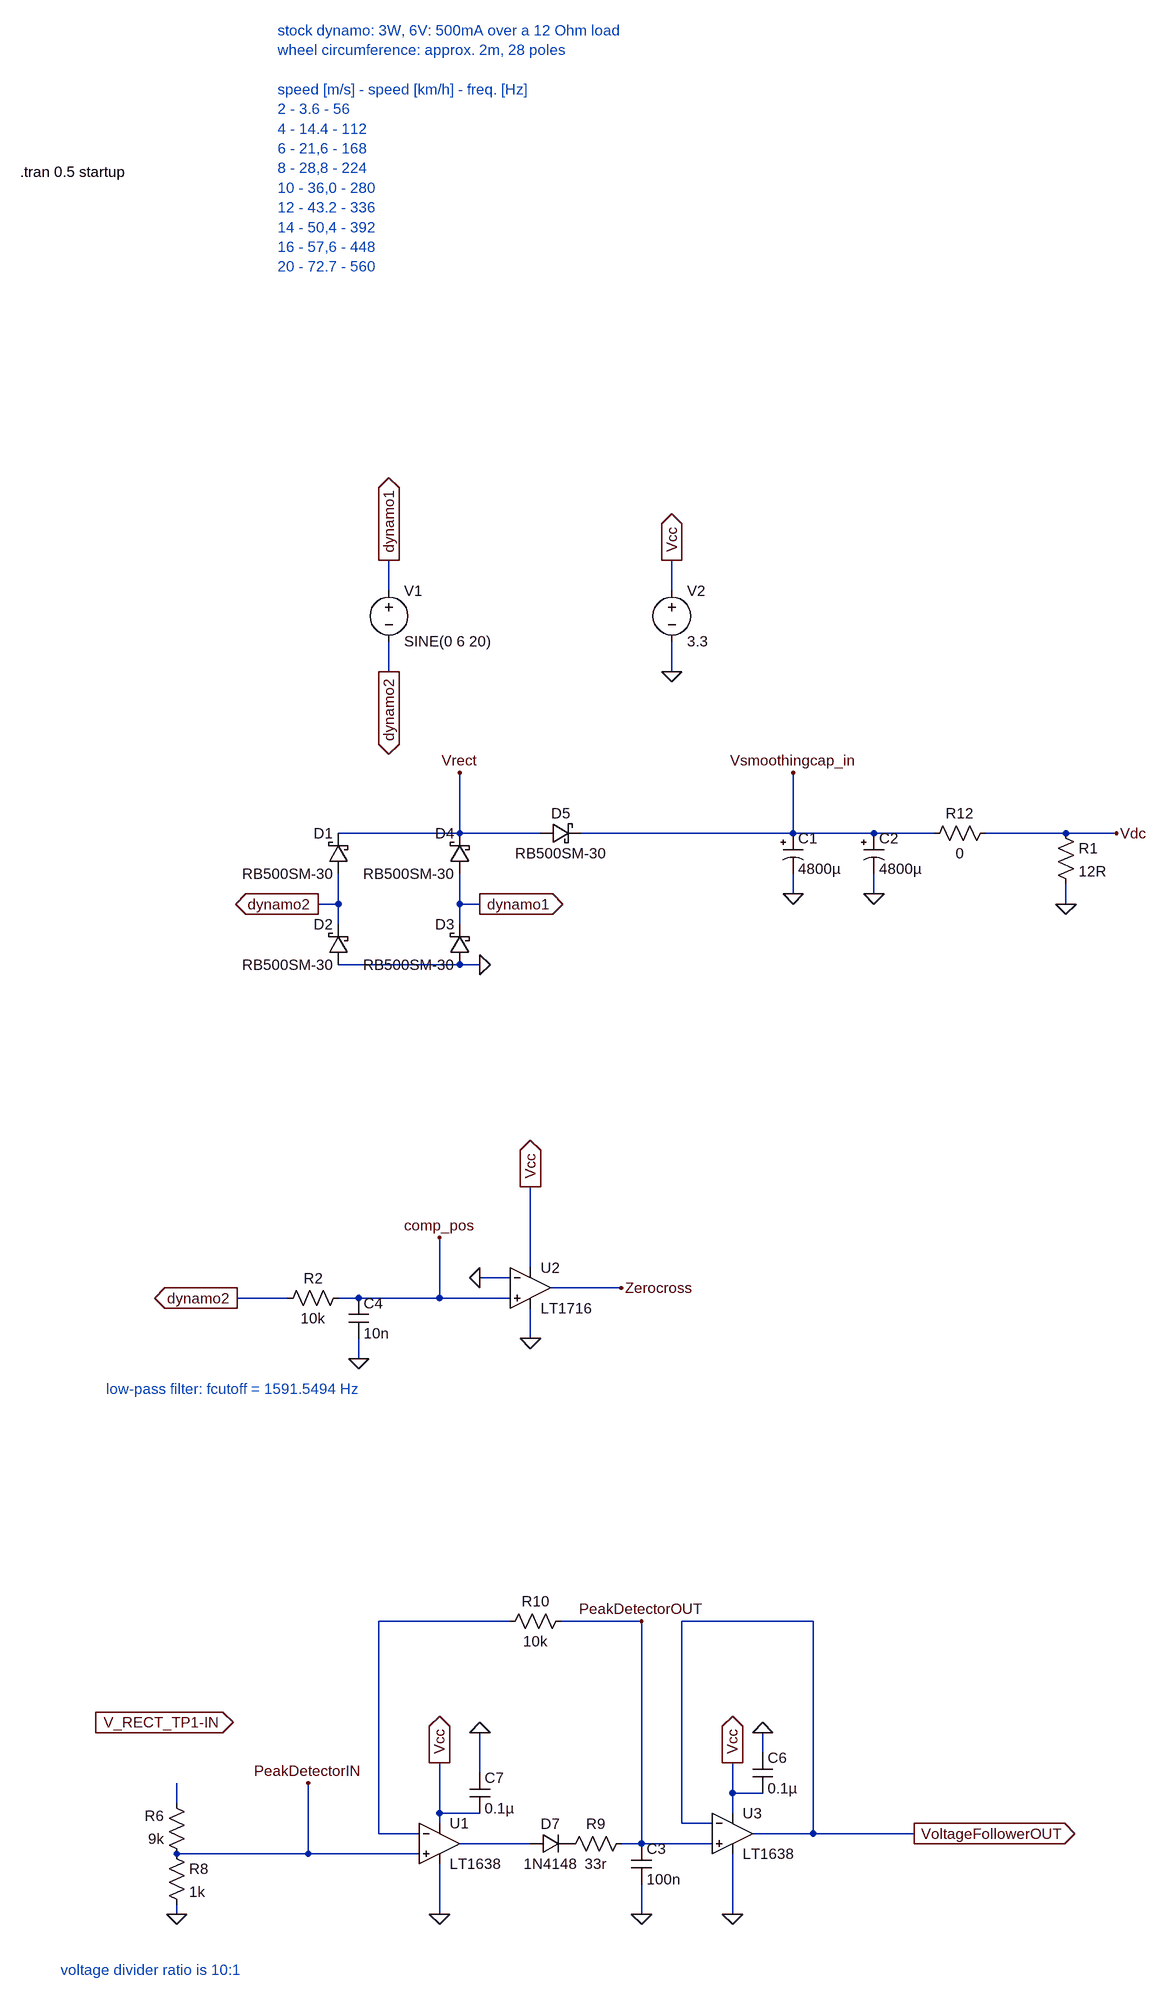
[diagram p0: schematic graetz and zero cross.asc]
graetz and zero cross.asc, the LTspice schematic file:
Version 4.1
SHEET 1 4188 3140
WIRE -992 32 -992 -16
WIRE -544 32 -544 -16
WIRE -992 160 -992 112
WIRE -544 160 -544 112
WIRE -880 416 -880 320
WIRE -880 416 -1072 416
WIRE -752 416 -880 416
WIRE -352 416 -352 320
WIRE -352 416 -688 416
WIRE -224 416 -352 416
WIRE -128 416 -224 416
WIRE 80 416 -48 416
WIRE 160 416 80 416
WIRE -352 512 -352 480
WIRE -224 512 -224 480
WIRE -1072 528 -1072 480
WIRE -1072 528 -1104 528
WIRE -880 528 -880 480
WIRE -848 528 -880 528
WIRE 80 528 80 496
WIRE -1072 560 -1072 528
WIRE -880 560 -880 528
WIRE -880 624 -1072 624
WIRE -848 624 -880 624
WIRE -768 1104 -768 976
WIRE -800 1120 -848 1120
WIRE -624 1136 -736 1136
WIRE -1152 1152 -1232 1152
WIRE -1040 1152 -1072 1152
WIRE -912 1152 -912 1056
WIRE -912 1152 -1040 1152
WIRE -800 1152 -912 1152
WIRE -768 1216 -768 1168
WIRE -1040 1248 -1040 1216
WIRE -800 1664 -1008 1664
WIRE -592 1664 -720 1664
WIRE -320 1664 -528 1664
WIRE -400 1872 -400 1840
WIRE -848 1904 -848 1840
WIRE -448 1936 -448 1888
WIRE -400 1936 -448 1936
WIRE -1328 1952 -1328 1920
WIRE -912 1968 -912 1888
WIRE -848 1968 -912 1968
WIRE -448 1968 -448 1936
WIRE -912 1984 -912 1968
WIRE -528 1984 -528 1664
WIRE -480 1984 -528 1984
WIRE -1008 2000 -1008 1664
WIRE -944 2000 -1008 2000
WIRE -320 2000 -320 1664
WIRE -320 2000 -416 2000
WIRE -160 2000 -320 2000
WIRE -768 2016 -880 2016
WIRE -592 2016 -592 1664
WIRE -592 2016 -624 2016
WIRE -480 2016 -592 2016
WIRE -1120 2032 -1120 1920
WIRE -1120 2032 -1328 2032
WIRE -944 2032 -1120 2032
WIRE -1328 2128 -1328 2112
WIRE -912 2128 -912 2048
WIRE -592 2128 -592 2080
WIRE -448 2128 -448 2032
FLAG -992 -16 dynamo1
IOPIN -992 -16 Out
FLAG -992 160 dynamo2
IOPIN -992 160 Out
FLAG -848 624 0
FLAG 80 528 0
FLAG -848 528 dynamo1
IOPIN -848 528 Out
FLAG -1104 528 dynamo2
IOPIN -1104 528 Out
FLAG -352 512 0
FLAG -224 512 0
FLAG -544 160 0
FLAG -544 -16 Vcc
IOPIN -544 -16 Out
FLAG -768 1216 0
FLAG -1232 1152 dynamo2
IOPIN -1232 1152 Out
FLAG -592 2128 0
FLAG -912 2128 0
FLAG -1328 2128 0
FLAG -1456 1824 V_RECT_TP1-IN
IOPIN -1456 1824 Out
FLAG -448 2128 0
FLAG -160 2000 VoltageFollowerOUT
IOPIN -160 2000 Out
FLAG -1120 1920 PeakDetectorIN
FLAG -592 1664 PeakDetectorOUT
FLAG -400 1840 0
FLAG -848 1840 0
FLAG -1040 1248 0
FLAG -912 1056 comp_pos
FLAG -448 1888 Vcc
IOPIN -448 1888 Out
FLAG -912 1888 Vcc
IOPIN -912 1888 Out
FLAG -848 1120 0
FLAG -768 976 Vcc
IOPIN -768 976 Out
FLAG -880 320 Vrect
FLAG -352 320 Vsmoothingcap_in
FLAG 160 416 Vdc
FLAG -624 1136 Zerocross
SYMBOL voltage -992 16 R0
WINDOW 123 24 124 Left 2
WINDOW 39 0 0 Left 0
SYMATTR InstName V1
SYMATTR Value SINE(0 6 20)
SYMBOL res 64 400 R0
SYMATTR InstName R1
SYMATTR Value 12R
SYMBOL schottky -1056 480 R180
WINDOW 0 24 64 Left 2
WINDOW 3 24 0 Left 2
SYMATTR InstName D1
SYMATTR Value RB500SM-30
SYMATTR Description Diode
SYMATTR Type diode
SYMBOL schottky -1056 624 R180
WINDOW 0 24 64 Left 2
WINDOW 3 24 0 Left 2
SYMATTR InstName D2
SYMATTR Value RB500SM-30
SYMATTR Description Diode
SYMATTR Type diode
SYMBOL schottky -864 624 R180
WINDOW 0 24 64 Left 2
WINDOW 3 24 0 Left 2
SYMATTR InstName D3
SYMATTR Value RB500SM-30
SYMATTR Description Diode
SYMATTR Type diode
SYMBOL schottky -864 480 R180
WINDOW 0 24 64 Left 2
WINDOW 3 24 0 Left 2
SYMATTR InstName D4
SYMATTR Value RB500SM-30
SYMATTR Description Diode
SYMATTR Type diode
SYMBOL polcap -368 416 R0
SYMATTR InstName C1
SYMATTR Value 4800µ
SYMBOL schottky -752 432 R270
WINDOW 0 32 32 VTop 2
WINDOW 3 0 32 VBottom 2
SYMATTR InstName D5
SYMATTR Value RB500SM-30
SYMATTR Description Diode
SYMATTR Type diode
SYMBOL voltage -544 16 R0
WINDOW 123 0 0 Left 0
WINDOW 39 0 0 Left 0
SYMATTR InstName V2
SYMATTR Value 3.3
SYMBOL polcap -240 416 R0
SYMATTR InstName C2
SYMATTR Value 4800µ
SYMBOL Opamps\\LT1638 -912 1952 R0
SYMATTR InstName U1
SYMBOL diode -768 2032 R270
WINDOW 0 32 32 VTop 2
WINDOW 3 0 32 VBottom 2
SYMATTR InstName D7
SYMATTR Value 1N4148
SYMBOL cap -608 2016 R0
SYMATTR InstName C3
SYMATTR Value 100n
SYMBOL res -1312 2048 R180
WINDOW 0 36 76 Left 2
WINDOW 3 36 40 Left 2
SYMATTR InstName R6
SYMATTR Value 9k
SYMBOL res -1344 2016 R0
SYMATTR InstName R8
SYMATTR Value 1k
SYMBOL Opamps\\LT1638 -448 1936 R0
SYMATTR InstName U3
SYMBOL res -608 2000 R90
WINDOW 0 0 56 VBottom 2
WINDOW 3 32 56 VTop 2
SYMATTR InstName R9
SYMATTR Value 33r
SYMBOL res -704 1648 R90
WINDOW 0 0 56 VBottom 2
WINDOW 3 32 56 VTop 2
SYMATTR InstName R10
SYMATTR Value 10k
SYMBOL cap -416 1872 R0
SYMATTR InstName C6
SYMATTR Value 0.1µ
SYMBOL cap -864 1904 R0
SYMATTR InstName C7
SYMATTR Value 0.1µ
SYMBOL cap -1056 1152 R0
SYMATTR InstName C4
SYMATTR Value 10n
SYMBOL res -1056 1136 R90
WINDOW 0 0 56 VBottom 2
WINDOW 3 32 56 VTop 2
SYMATTR InstName R2
SYMATTR Value 10k
SYMBOL Comparators\\LT1716 -768 1136 R0
SYMATTR InstName U2
SYMBOL res -32 400 R90
WINDOW 0 0 56 VBottom 2
WINDOW 3 32 56 VTop 2
SYMATTR InstName R12
SYMATTR Value 0
TEXT -1168 -856 Left 2 ;stock dynamo: 3W, 6V: 500mA over a 12 Ohm load\nwheel circumference: approx. 2m, 28 poles\n \nspeed [m/s] - speed [km/h] - freq. [Hz]\n2 - 3.6 - 56\n4 - 14.4 - 112\n6 - 21,6 - 168\n8 - 28,8 - 224\n10 - 36,0 - 280\n12 - 43.2 - 336\n14 - 50,4 - 392\n16 - 57,6 - 448\n20 - 72.7 - 560
TEXT -1440 1296 Left 2 ;low-pass filter: fcutoff = 1591.5494 Hz
TEXT -1576 -632 Left 2 !.tran 0.5 startup
TEXT -1512 2216 Left 2 ;voltage divider ratio is 10:1

The netlist it stands for:
* graetz and zero cross.asc
V1 dynamo1 dynamo2 SINE(0 6 20)
R1 Vdc 0 12R
D1 dynamo2 Vrect RB500SM-30
D2 0 dynamo2 RB500SM-30
D3 0 dynamo1 RB500SM-30
D4 dynamo1 Vrect RB500SM-30
C1 Vsmoothingcap_in 0 4800µ
D5 Vrect Vsmoothingcap_in RB500SM-30
V2 Vcc 0 3.3
C2 Vsmoothingcap_in 0 4800µ
X§U1 PeakDetectorIN N001 Vcc 0 N003 LT1638  ; pins In+ In- V+ V- OUT
D7 N003 P001 1N4148
C3 PeakDetectorOUT 0 100n
R6 PeakDetectorIN N002 9k
R8 PeakDetectorIN 0 1k
X§U3 PeakDetectorOUT VoltageFollowerOUT Vcc 0 VoltageFollowerOUT LT1638  ; pins In+ In- V+ V- OUT
R9 PeakDetectorOUT P001 33r
R10 PeakDetectorOUT N001 10k
C6 0 Vcc 0.1µ
C7 0 Vcc 0.1µ
C4 comp_pos 0 10n
R2 comp_pos dynamo2 10k
X§U2 comp_pos 0 Vcc 0 Zerocross LT1716  ; pins In+ In- V+ V- OUT
R12 Vdc Vsmoothingcap_in 0
.model D D
.lib standard.dio
* stock dynamo: 3W, 6V: 500mA over a 12 Ohm load
* wheel circumference: approx. 2m, 28 poles
* speed [m/s] - speed [km/h] - freq. [Hz]
* 2 - 3.6 - 56
* 4 - 14.4 - 112
* 6 - 21,6 - 168
* 8 - 28,8 - 224
* 10 - 36,0 - 280
* 12 - 43.2 - 336
* 14 - 50,4 - 392
* 16 - 57,6 - 448
* 20 - 72.7 - 560
* low-pass filter: fcutoff = 1591.5494 Hz
.tran 0.5 startup
* voltage divider ratio is 10:1
.lib LTC1.lib
.backanno
.end